# Altium schematic sheet CAN.SchDoc
size B; Organization: Pyrotechnics Management Inc.; DocumentNumber: 7; SheetNumber: 7; SheetTotal: 14; PageSetup: Record=PageOptions|CenterHorizontal=True|CenterVertical=True|PrintScale=0.99|XCorrection=1.00|YCorrection=1.00|PrintKind=1|BorderSize=5000000|LeftOffset=0|BottomOffset=0|Orientation=2|PaperLength=1000|PaperWidth=1000|Scale=100|PaperSource=7|PrintQuality=-4|MediaType=1|DitherType=10|PaperKind=Tabloid (11 x 17")|PrintScaleMode=1; SCHEMATIC_SHEET_TITLE: CAN INTERFACE; PAGE_TITLE: Top Level
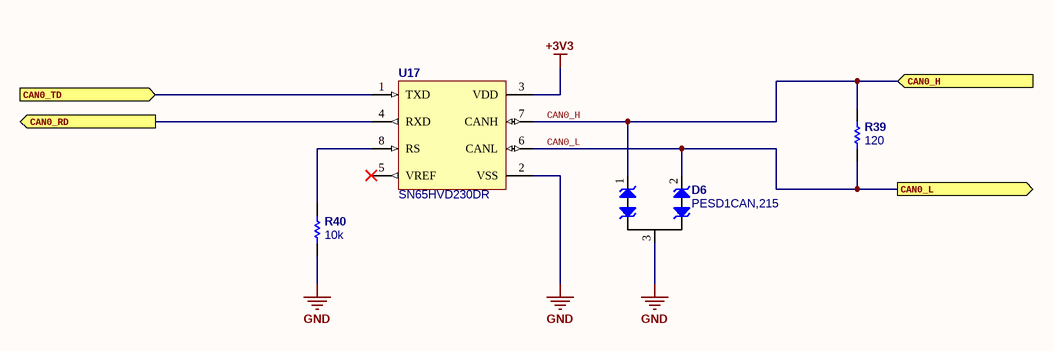
[diagram p0: CAN.SchDoc]

## Parts
D6  PESD1CAN,215  [SOT23_MEDIUM]
R39  120  [R1206_0.70MM_HD]
R40  10k  [R0603_0.55MM_MD]
U17  SN65HVD230DR  [SOIC-8]

## Ports
CAN0_H (in), CAN0_L (out), CAN0_RD (out), CAN0_TD (in)

## Nets
+3V3: U17.3(VDD)
GND: D6.3(A) R40.1 U17.2(VSS)
CAN0_H: D6.1(C1) R39.2 U17.7(CANH) ; port CAN0_H
CAN0_L: D6.2(C2) R39.1 U17.6(CANL) ; port CAN0_L
CAN0_RD: U17.4(RXD) ; port CAN0_RD
CAN0_TD: U17.1(TXD) ; port CAN0_TD
NetR40_2: R40.2 U17.8(RS)

Not connected (* = marked no-connect by the designer): U17 5(VREF)*

## Notes on the sheet
- PCB REV
- Sheet
- of
- CCA REV

## Library data of the parts
D6 = PESD1CAN,215: TVS DIODE 24VWM 70VC SOT23; Manufacturer: NXP Semiconductors; CategorySort: 400; Type: Zener; Bidirectional Channels: 2; Voltage - Reverse Standoff (Typ): 24V (Max); Voltage - Breakdown (Min): 25.4V; Voltage - Clamping (Max) @ Ipp: 70V; Current - Peak Pulse (10/1000µs): 3A (8/20µs); Power - Peak Pulse: 200W; Power Line Protection: No; Capacitance @ Frequency: 11pF @ 1MHz; Value: PESD1CAN,215; Sort Value: *; Category: Diodes; Supplier 1: Digi-Key; Supplier Part Number 1: 568-4032-1-ND; Manufacturer Part Number: PESD1CAN,215; RoHS: RoHS Compliant; Stock 1: 57937; Pricing 1: 1=0.55, 10=0.386, 25=0.3176, 100=0.2537, 250=0.1848, 500=0.15008, 1000=0.11536 (USD); Packaging: Cut Tape (CT); Unidirectional Channels: -; Applications: Automotive; Operating Temperature: -65°C ~ 150°C; Mounting Type: Surface Mount; Package: TO-236-3, SC-59, SOT-23-3; Supplier Device Package: SOT-23-3; ComponentLink1URL: http://www.nxp.com/documents/data_sheet/PESD1CAN.pdf; ComponentLink1Description: http://www.nxp.com/documents/data_sheet/PESD1CAN.pdf; Manufacturer 1: NXP Semiconductors; Manufacturer Part Number 1: PESD1CAN,215
R39 = ERJ-8ENF1200V: RES 120 OHM 1/4W 1% 1206 SMD; Manufacturer: Panasonic Electronic Components; Power (Watts): 0.25W- 1/4W; Temperature Coefficient: ±100ppm/°C; Package Power: 1206  (0.25W); Limiting Element Voltage: 200; Maximum Overload Voltage: 400; Maximum Working Voltage: 5.5V; Substitution Notes: 120 , ±1% , 1206 , AEC-Q200; Value: 120; Supplier 1: Digi-Key; Supplier Part Number 1: P120FCT-ND; Manufacturer Part Number: ERJ-8ENF1200V; Category: Resistors; Sort Value: 120; Composition: Thick Film; Features: -; Tolerance: ±1%; Package: 1206 (3216 Metric); Size / Dimension: 0.126" L x 0.063" W (3.20mm x 1.60mm); Height: 0.70MM; Packaging: Cut Tape (CT); ComponentLink1URL: datasheets\Panasonic Electronic Components\AOA0000CE2.pdf; ComponentLink1Description: Internal Datasheet; ComponentLink2Description: External Datasheet; ComponentLink2URL: http://industrial.panasonic.com/www-data/pdf/AOA0000/AOA0000CE2.pdf; Resistance (Ohms): 120; Supplier Package: 1206; Number of Terminations: 2; Sort Value Package: 1206_120; Ratings: AEC-Q200
R40 = ERJ-3EKF1002V: RES 10K OHM 1/10W 1% 0603 SMD; Manufacturer: Panasonic Electronic Components; Power (Watts): 0.1W- 1/10W; Temperature Coefficient: ±100ppm/°C; Package Power: 0603  (0.1W); Limiting Element Voltage: 75; Maximum Overload Voltage: 150; Maximum Working Voltage: 31.6V; Substitution Notes: 10k , ±1% , 0603 , AEC-Q200; Value: 10k; Supplier 1: Digi-Key; Supplier Part Number 1: P10.0KHCT-ND; Manufacturer Part Number: ERJ-3EKF1002V; Category: Resistors; Sort Value: 10000; Composition: Thick Film; Features: -; Tolerance: ±1%; Package: 0603 (1608 Metric); Size / Dimension: 0.063" L x 0.031" W (1.60mm x 0.80mm); Height: 0.55MM; Packaging: Cut Tape (CT); ComponentLink1URL: datasheets\Panasonic Electronic Components\AOA0000CE2.pdf; ComponentLink1Description: Internal Datasheet; ComponentLink2Description: External Datasheet; ComponentLink2URL: http://industrial.panasonic.com/www-data/pdf/AOA0000/AOA0000CE2.pdf; Resistance (Ohms): 10k; Supplier Package: 0603; Number of Terminations: 2; Sort Value Package: 603_10000; Ratings: AEC-Q200
U17 = SN65HVD230DR: CAN Interface IC STANDBY MODE; Manufacturer: Texas Instruments; CategorySort: 600; Data Rate: 1 Mbps; Operating Supply Voltage: 3.3 V; Supply Voltage - Max: 3.6 V; Supply Voltage - Min: 3 V; Value: SN65HVD230DR; Sort Value: *; Category: Integrated Circuits; Supplier 1: Mouser; Supplier Part Number 1: 595-SN65HVD230DR; Manufacturer Part Number: SN65HVD230DR; RoHS: RoHS Compliant; Stock 1: 6781; Pricing 1: 1=1.95, 10=1.62, 25=1.44, 100=0.972, 250=0.954, 500=0.935, 750=0.917, 2500=0.900 (USD); Package: SOIC-8; Packaging: Reel; Series: SN65HVD230; Type: Transceiver; Mounting Style: SMD/SMT; Maximum Operating Temperature: + 85 C; Minimum Operating Temperature: - 40 C; Product Category: Display Interface; Standard Pack Qty: 2500; RoHS - Mouser: Y; Minimum Order Quantity: 1; Reeling: True; ComponentLink1URL: http://www.ti.com/litv/slos346k; ComponentLink1Description: http://www.ti.com/litv/slos346k